# Altium schematic sheet Full_Adder.SchDoc
size A
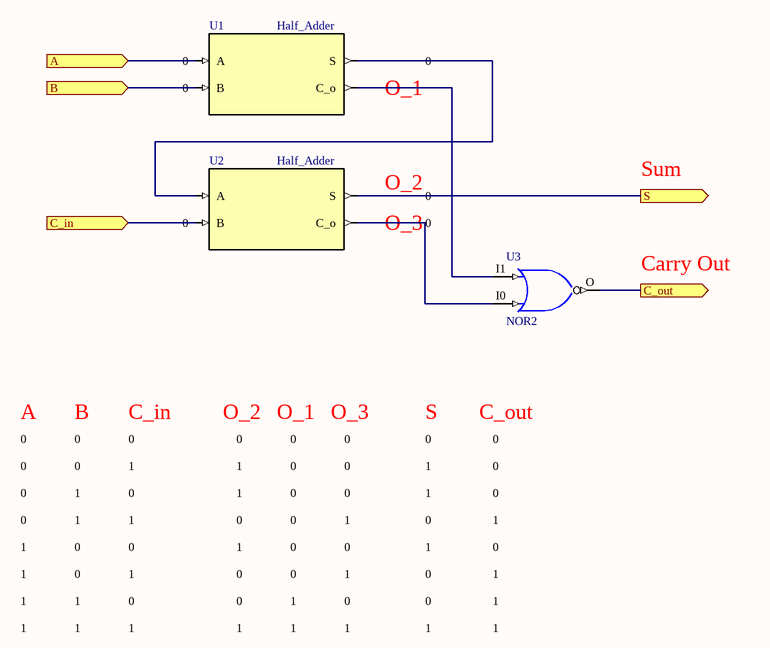
[diagram p0: Full_Adder.SchDoc]

## Parts
U1  Half_Adder
U2  Half_Adder
U3  NOR2

## Ports
A (in), B (in), C_in (in), C_out (out), S (out)

## Nets
A: U1.A ; port A
B: U1.B ; port B
C_in: U2.B ; port C_in
C_out: U3.O ; port C_out
S: U2.S ; port S
NetU1_C_O: U1.C_O(C_o) U3.I1
NetU1_S: U1.S U2.A
NetU2_C_O: U2.C_O(C_o) U3.I0

## Notes on the sheet
- (near U1) 0
- 0
- (near U1) O_1
- (near U2) O_2
- Sum
- (near U2) 0
- (near U2) O_3
- Carry Out
- A
- B
- C_in
- O_2
- O_1
- O_3
- S
- C_out
- 1

## Library data of the parts
U1 U2 = Half_Adder_BS
U3 = NOR2: 2-Input NOR Gate; FPGAVendor: CUPL; Published: 17-Apr-2002; Publisher: Altium Limited